# EAGLE design AeroQuadMini_v105 (EAGLE 5.11)
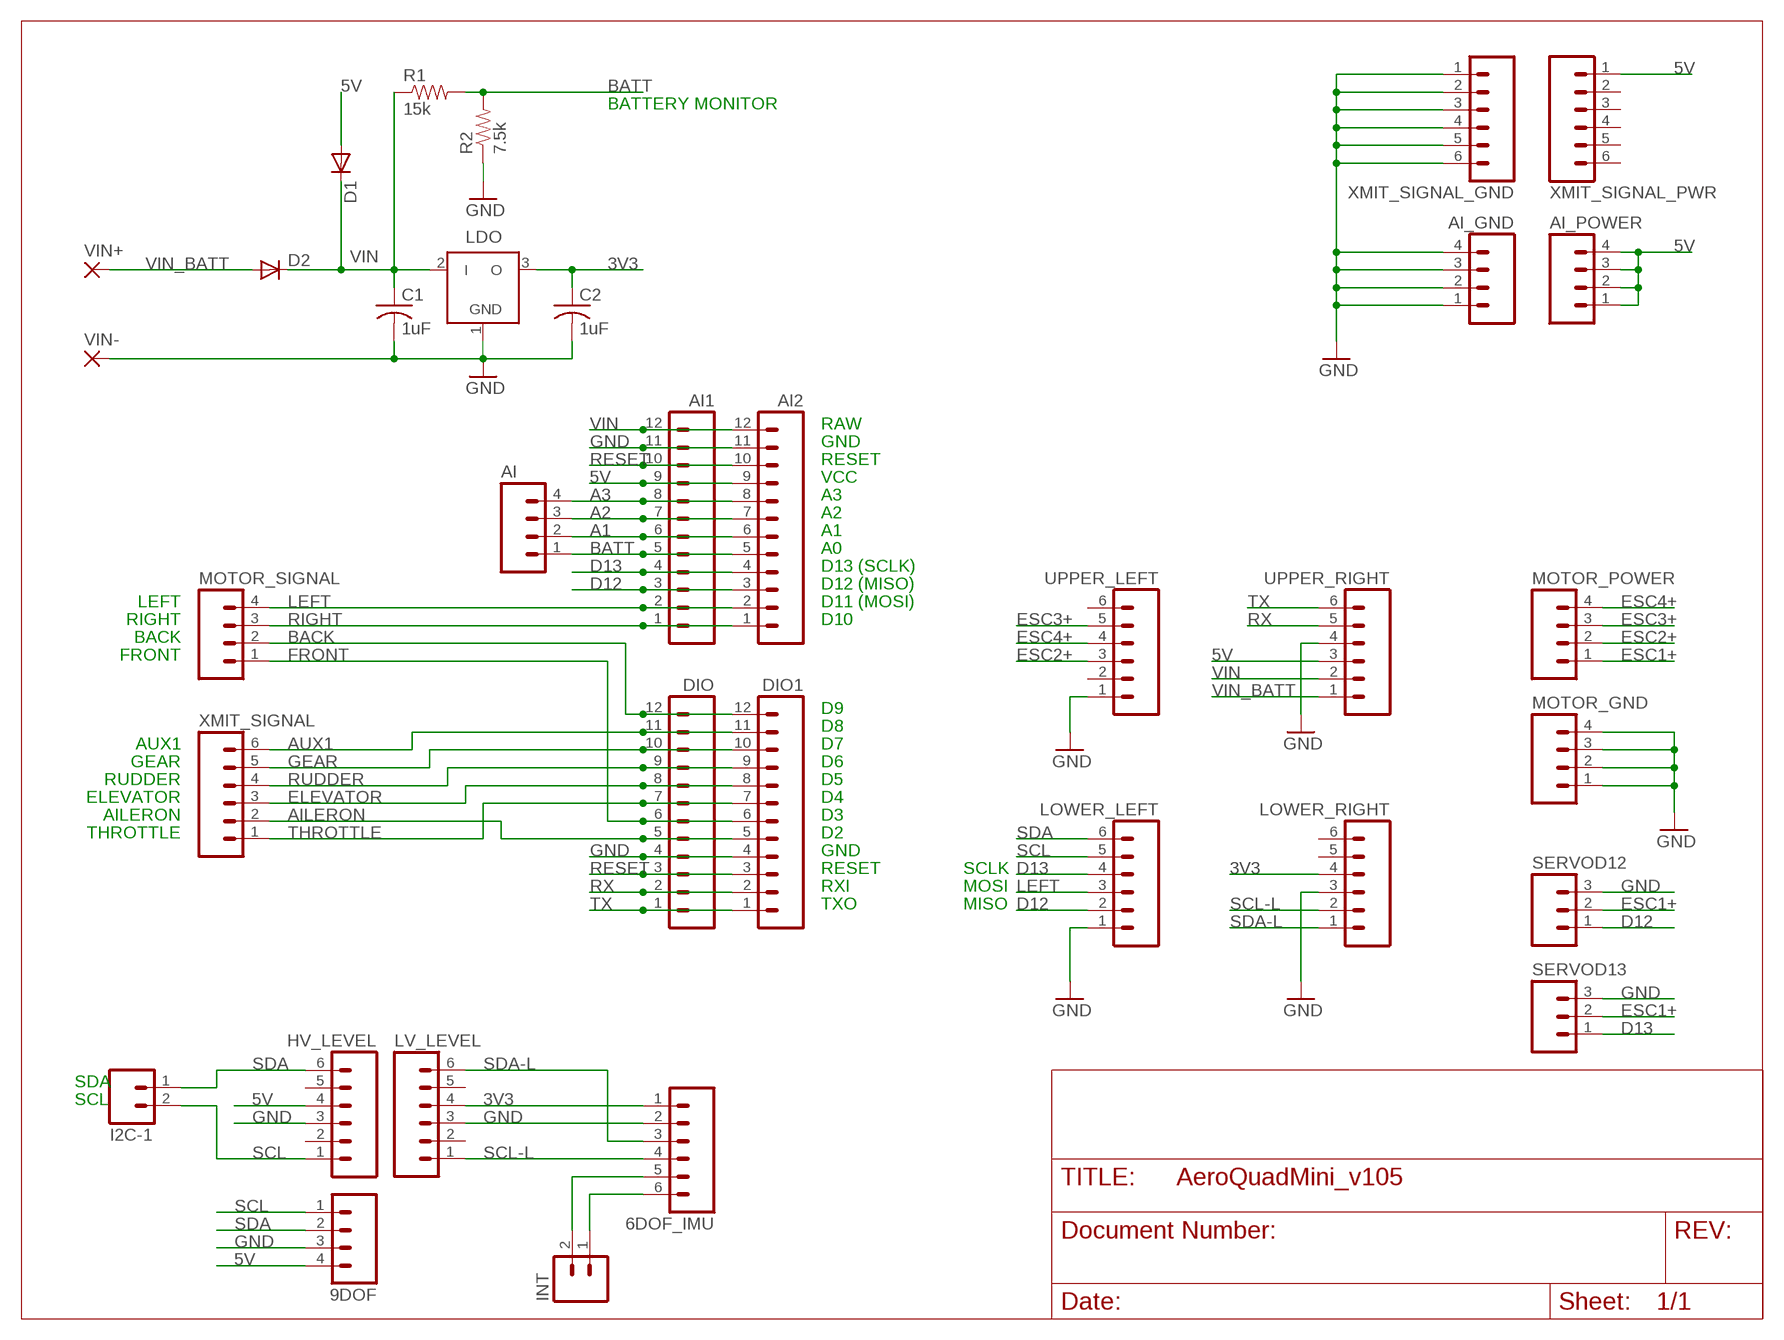
[diagram p0: schematic, sheet 1]

## Parts
6DOF_IMU  M06LOCK  [1X06_LOCK]
9DOF  M04LOCK  [1X04_LOCK]
AI  M04LOCK  [1X04_LOCK]
AI1  M12LOCK  [1X12_LOCK]
AI2  M12LOCK  [1X12_LOCK]
AI_GND  M04LOCK  [1X04_LOCK]
AI_POWER  M04LOCK  [1X04_LOCK]
C1  1uF  C-US050-024X044  [C050-024X044]
C2  1uF  C-US050-024X044  [C050-024X044]
D1  DIODEPTH  [DIODE-1N4001]
D2  DIODEPTH  [DIODE-1N4001]
DIO  M12LOCK  [1X12_LOCK]
DIO1  M12LOCK  [1X12_LOCK]
HV_LEVEL  M06LOCK  [1X06_LOCK]
I2C-1  M02LOCK  [1X02_LOCK]
INT  M02PTH  [1X02]
LDO  MCP1702-33  MCP1702Z  [TO92]
LOWER_LEFT  M06LOCK  [1X06_LOCK]
LOWER_RIGHT  M06LOCK  [1X06_LOCK]
LV_LEVEL  M06LOCK  [1X06_LOCK]
MOTOR_GND  M04LOCK  [1X04_LOCK]
MOTOR_POWER  M04LOCK  [1X04_LOCK]
MOTOR_SIGNAL  M04LOCK  [1X04_LOCK]
R1  15k  RESISTORPTH-1/6W  [1/6W-RES]
R2  7.5k  RESISTORPTH-1/6W  [1/6W-RES]
SERVOD12  M03LOCK  [1X03_LOCK]
SERVOD13  M03LOCK  [1X03_LOCK]
UPPER_LEFT  M06LOCK  [1X06_LOCK]
UPPER_RIGHT  M06LOCK  [1X06_LOCK]
VIN+  3,81/1,4  [3,81/1,4]
VIN-  3,81/1,4  [3,81/1,4]
XMIT_SIGNAL  M06LOCK  [1X06_LOCK]
XMIT_SIGNAL_GND  M06LOCK  [1X06_LOCK]
XMIT_SIGNAL_PWR  M06LOCK  [1X06_LOCK]

## Nets
3V3: 6DOF_IMU.1 C2.1 LDO.3(O) LOWER_RIGHT.4 LV_LEVEL.4
5V: 9DOF.4 AI1.9 AI2.9 AI_POWER.1 AI_POWER.2 AI_POWER.3 AI_POWER.4 D1.A HV_LEVEL.4 UPPER_RIGHT.3 XMIT_SIGNAL_PWR.1
A1: AI1.6 AI2.6 AI.2
A2: AI1.7 AI2.7 AI.3
A3: AI1.8 AI2.8 AI.4
AILERON: DIO1.5 DIO.5 XMIT_SIGNAL.2
AUX1: DIO1.11 DIO.11 XMIT_SIGNAL.6
BACK: DIO1.12 DIO.12 MOTOR_SIGNAL.2
BATT: AI1.5 AI2.5 AI.1 R1.2 R2.2
D12: AI1.3 AI2.3 LOWER_LEFT.2 SERVOD12.1
D13: AI1.4 AI2.4 LOWER_LEFT.4 SERVOD13.1
ELEVATOR: DIO1.8 DIO.8 XMIT_SIGNAL.3
ESC1+: MOTOR_POWER.1 SERVOD12.2 SERVOD13.2
ESC2+: MOTOR_POWER.2 UPPER_LEFT.3
ESC3+: MOTOR_POWER.3 UPPER_LEFT.5
ESC4+: MOTOR_POWER.4 UPPER_LEFT.4
FRONT: DIO1.6 DIO.6 MOTOR_SIGNAL.1
GEAR: DIO1.10 DIO.10 XMIT_SIGNAL.5
GND: 6DOF_IMU.2 9DOF.3 AI1.11 AI2.11 AI_GND.1 AI_GND.2 AI_GND.3 AI_GND.4 C1.2 C2.2 DIO1.4 DIO.4 HV_LEVEL.3 LDO.1(GND) LOWER_LEFT.1 LOWER_RIGHT.3 LV_LEVEL.3 MOTOR_GND.1 MOTOR_GND.2 MOTOR_GND.3 MOTOR_GND.4 R2.1 SERVOD12.3 SERVOD13.3 UPPER_LEFT.1 UPPER_RIGHT.4 VIN-.1(P) XMIT_SIGNAL_GND.1 XMIT_SIGNAL_GND.2 XMIT_SIGNAL_GND.3 XMIT_SIGNAL_GND.4 XMIT_SIGNAL_GND.5 XMIT_SIGNAL_GND.6
LEFT: AI1.2 AI2.2 LOWER_LEFT.3 MOTOR_SIGNAL.4
N$1: 6DOF_IMU.5 INT.2
N$2: 6DOF_IMU.6 INT.1
RESET: AI1.10 AI2.10 DIO1.3 DIO.3
RIGHT: AI1.1 AI2.1 MOTOR_SIGNAL.3
RUDDER: DIO1.9 DIO.9 XMIT_SIGNAL.4
RX: DIO1.2 DIO.2 UPPER_RIGHT.5
SCL: 9DOF.1 HV_LEVEL.1 I2C-1.2 LOWER_LEFT.5
SCL-L: 6DOF_IMU.4 LOWER_RIGHT.2 LV_LEVEL.1
SDA: 9DOF.2 HV_LEVEL.6 I2C-1.1 LOWER_LEFT.6
SDA-L: 6DOF_IMU.3 LOWER_RIGHT.1 LV_LEVEL.6
THROTTLE: DIO1.7 DIO.7 XMIT_SIGNAL.1
TX: DIO1.1 DIO.1 UPPER_RIGHT.6
VIN: AI1.12 AI2.12 C1.1 D1.C D2.C LDO.2(I) R1.1 UPPER_RIGHT.2
VIN_BATT: D2.A UPPER_RIGHT.1 VIN+.1(P)
Unconnected: HV_LEVEL.2 HV_LEVEL.5 LOWER_RIGHT.5 LOWER_RIGHT.6 LV_LEVEL.2 LV_LEVEL.5 UPPER_LEFT.2 UPPER_LEFT.6 XMIT_SIGNAL_PWR.2 XMIT_SIGNAL_PWR.3 XMIT_SIGNAL_PWR.4 XMIT_SIGNAL_PWR.5 XMIT_SIGNAL_PWR.6

## Notes on the sheet
- BATTERY MONITOR
- RAW
- GND
- RESET
- VCC
- A3
- A2
- A1
- A0
- D13 (SCLK)
- D12 (MISO)
- LEFT | D11 (MOSI)
- RIGHT | D10
- BACK
- FRONT
- D9
- D8
- AUX1 | D7
- GEAR | D6
- RUDDER | D5
- ELEVATOR | D4
- AILERON | D3
- THROTTLE | D2
- GND
- RESET | SCLK
- RXI | MOSI
- TXO | MISO
- SDA
- SCL

## Library data of the parts
6DOF_IMU HV_LEVEL LOWER_LEFT LOWER_RIGHT LV_LEVEL UPPER_LEFT UPPER_RIGHT XMIT_SIGNAL XMIT_SIGNAL_GND XMIT_SIGNAL_PWR = SparkFun:M06: Header 6 Standard 6-pin 0.1" header. Use with straight break away headers (SKU : PRT-00116), right angle break away headers (PRT-00553), swiss pins (PRT-00743), machine pins (PRT-00117), and female headers (PRT-00115). Molex polarized connector foot print use with SKU : PRT-08094 with associated crimp pins and housings. NOTES ON THE VARIANTS LOCK and LOCK_LONGPADS... This footprint was designed to help hold the alignment of a through-hole component (i.e. 6-pin header) while soldering it into place. You may notice that each hole has been shifted either up or down by 0.005 of an inch from it's more standard position (which is a perfectly straight line). This slight alteration caused the pins (the squares in the middle) to touch the edges of the holes. Because they are alternating, it causes a "brace" to hold the component in place. 0.005 has proven to be the perfect amount of "off-center" position when using our standard breakaway headers. Although looks a little odd when you look at the bare footprint, once you have a header in there, the alteration is very hard to notice. Also, if you push a header all the way into place, it is covered up entirely on the bottom side. This idea of altering the position of holes to aid alignment will be further integrated into the Sparkfun Library for other footprints. It can help hold any component with 3 or more connection pins.
9DOF AI AI_GND AI_POWER MOTOR_GND MOTOR_POWER MOTOR_SIGNAL = SparkFun:M04: Header 4 Standard 4-pin 0.1" header. Use with straight break away headers (SKU : PRT-00116), right angle break away headers (PRT-00553), swiss pins (PRT-00743), machine pins (PRT-00117), and female headers (PRT-00115). Molex polarized connector foot print use with SKU : PRT-08231 with associated crimp pins and housings. 1MM SMD Version SKU: PRT-10208
AI1 AI2 DIO DIO1 = SparkFun:M12: Header 12 Standard 12-pin 0.1" header. Use with straight break away headers (SKU : PRT-00116), right angle break away headers (PRT-00553), swiss pins (PRT-00743), machine pins (PRT-00117), and female headers (PRT-00115).
C1 C2 = resistor:C-US: CAPACITOR, American symbol
D1 D2 = SparkFun:DIODE: Diode These are standard reverse protection diodes and small signal diodes. SMA package can handle up to about 1A. SOD-323 can handle about 200mA. What the SOD-323 package when ordering, there are some mfgs out there that are 5-pin packages.
I2C-1 INT = SparkFun:M02: Header 2 Standard 2-pin 0.1" header. Use with straight break away headers (SKU : PRT-00116), right angle break away headers (PRT-00553), swiss pins (PRT-00743), machine pins (PRT-00117), and female headers (PRT-00115). Molex polarized connector foot print use with SKU : PRT-08233 with associated crimp pins and housings.
LDO = JeeLabs:MCP1702: 200 mA, Low Power Low Dropout Voltage Regulator
R1 R2 = SparkFun:RESISTOR: Resistor Basic schematic elements and footprints for 0603, 1206, and PTH 1/10th watt (small) resistors.
SERVOD12 SERVOD13 = SparkFun:M03: Header 3 Standard 3-pin 0.1" header. Use with straight break away headers (SKU : PRT-00116), right angle break away headers (PRT-00553), swiss pins (PRT-00743), machine pins (PRT-00117), and female headers (PRT-00115). Molex polarized connector foot print use with SKU : PRT-08232 with associated crimp pins and housings.
VIN+ VIN- = wirepad:3,81/1,4: THROUGH-HOLE PAD

## Net classes
1 power: width 0.381 mm, clearance 0.254 mm

## Board
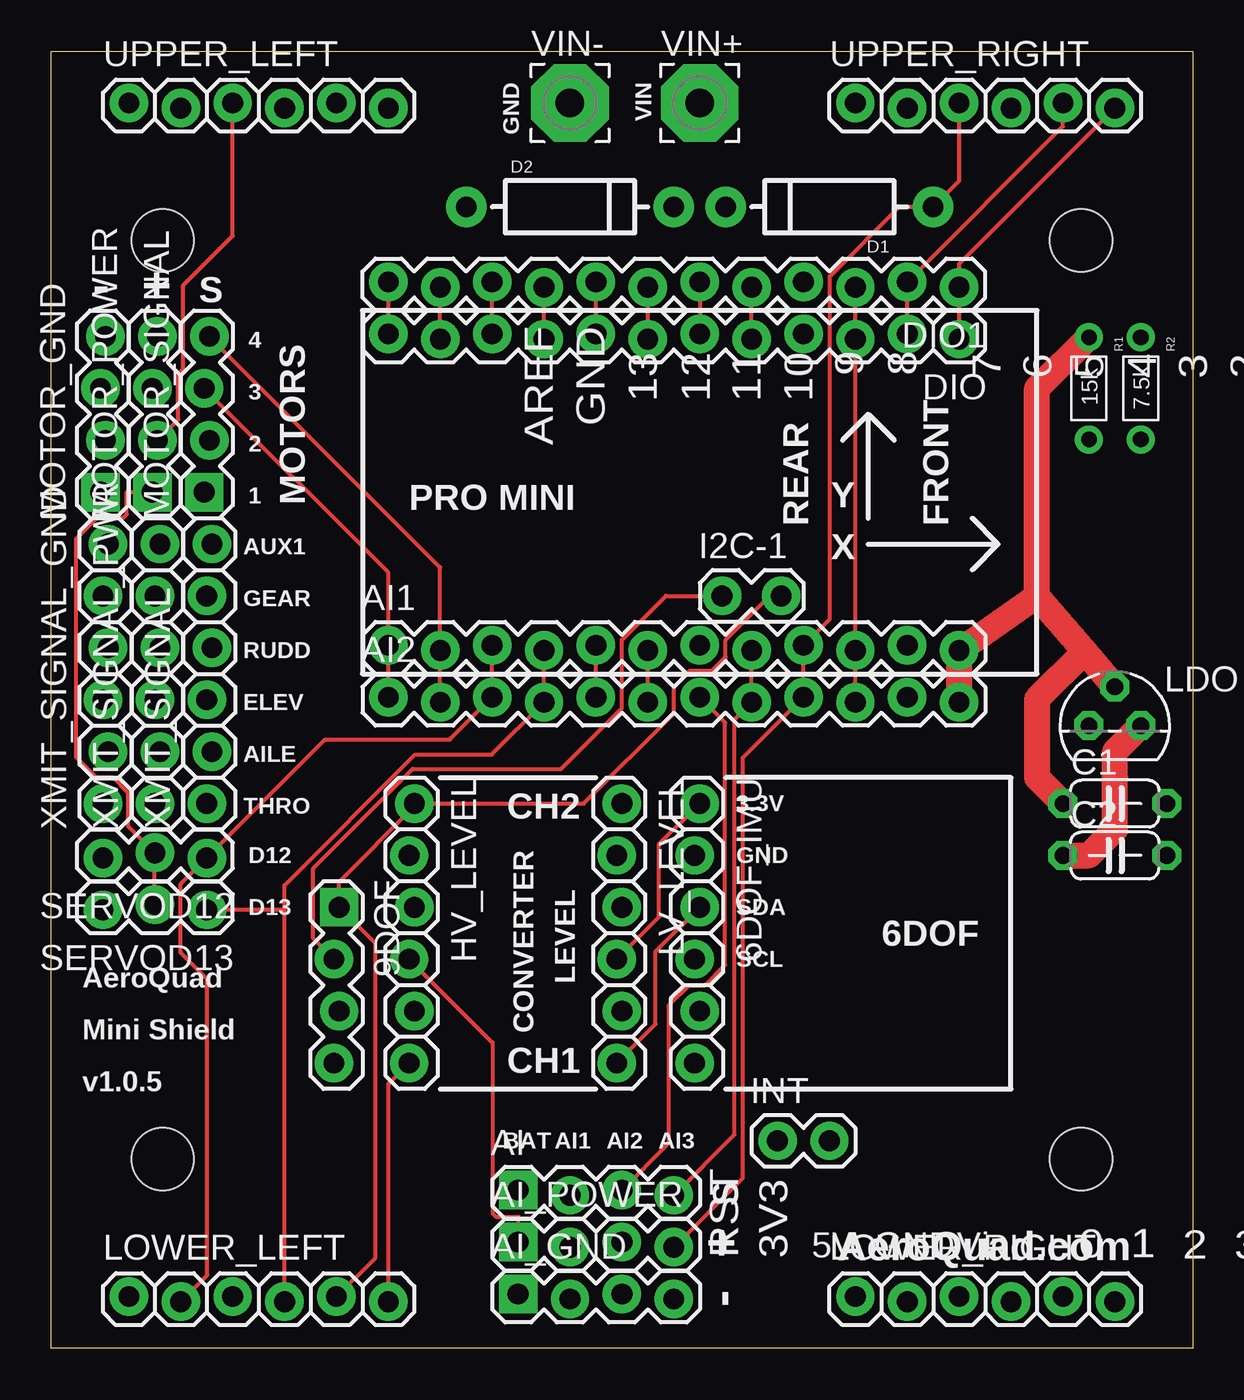
[diagram p1: board, top side]
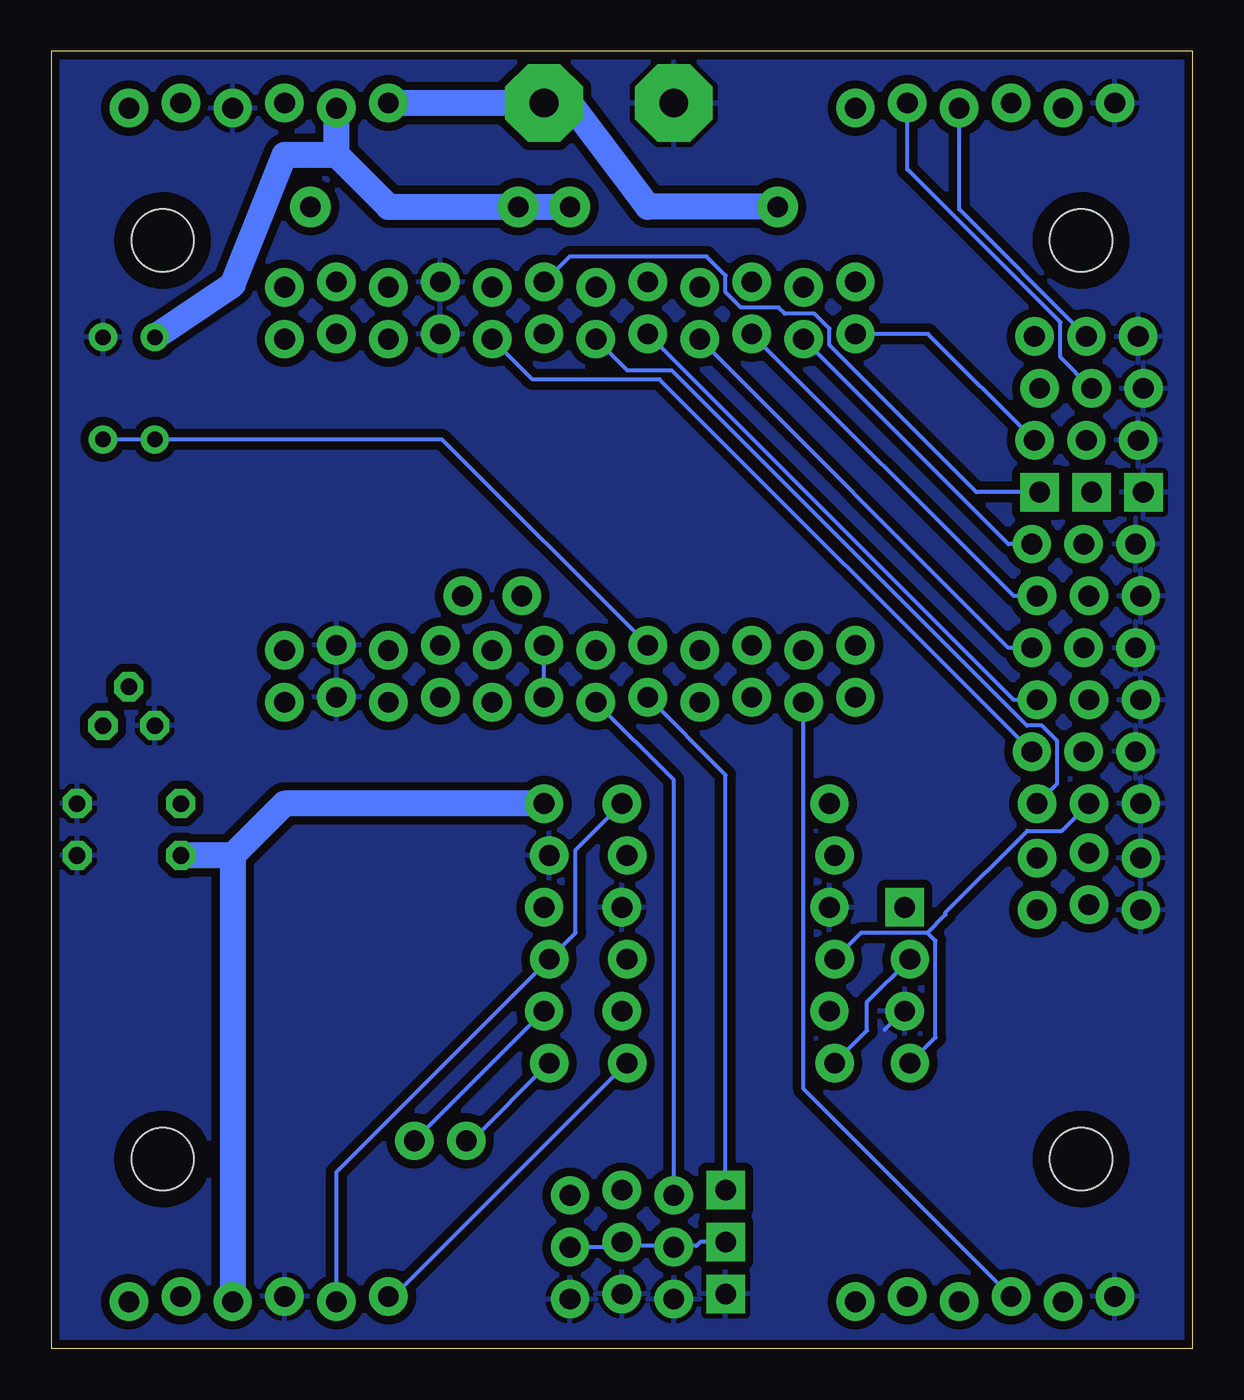
[diagram p2: board, bottom side, seen from below]

Size 55.88 x 63.5 mm. Coordinates in mm from the lower left corner, seen from the top.
Outline: 0,63.5 55.88,63.5 55.88,0 0,0 0,63.5
Copper layers (1*16): Top 0.035mm / dielectric 1.5mm / Bottom 0.035mm
Design rules "SparkFun": minimum track width 8mil, minimum drill 20mil, track to track 8mil, track to pad 8mil, pad to pad 8mil, via to via 8mil, smd to smd 8mil, copper to edge 10mil, drill to drill 8mil, minimum pad ring 12mil, minimum via ring 10mil, stop-mask expansion 4mil, vias tented up to drill 25mil, thermal gap 10mil

### Footprints (pad centres in the part's own frame; a part is rotated, then mirrored left to right if it is on the bottom)
1X06_LOCK = drill 1.016 pad 1.88 round: 1 0,0; 2 2.54,-0.254; 3 5.08,0; 4 7.62,-0.254; 5 10.16,0; 6 12.7,-0.254
1X04_LOCK = drill 1.016 pad 1.88 square: 1 0,0.127 | drill 1.016 pad 1.88 round: 2 2.54,-0.127; 3 5.08,0.127; 4 7.62,-0.127
1X12_LOCK = drill 1.016 pad 1.88 round: 1 0,0.127; 2 2.54,-0.127; 3 5.08,0.127; 4 7.62,-0.127; 5 10.16,0.127; 6 12.7,-0.127; 7 15.24,0.127; 8 17.78,-0.127; 9 20.32,0.127; 10 22.86,-0.127; 11 25.4,0.127; 12 27.94,-0.127
C050-024X044 = drill 0.813 octagon: 1 -2.54,0; 2 2.54,0
DIODE-1N4001 = drill 1 pad 1.981 round: A -5.08,0; C 5.08,0
1X02_LOCK = drill 1.016 pad 1.88 round: 1 -0.178,0; 2 2.718,0
1X02 = drill 1.016 pad 1.88 round: 1 0,0; 2 2.54,0
TO92 = drill 0.813 octagon: 1 -1.27,0; 2 0,1.905; 3 1.27,0
1/6W-RES = drill 0.762 round: 1 -2.5,0; 2 2.5,0
1X03_LOCK = drill 1.016 pad 1.88 round: 1 0,0.127; 2 2.54,-0.127; 3 5.08,0.127
STAND-OFF-TIGHT = hole 3.048: 0,0
3,81/1,4 = drill 1.397 pad 3.81 octagon: 1 0,0

### Placement (x,y rotation side)
6DOF_IMU  31.75,26.67 270 top
9DOF  13.97,21.59 270 top
AI  22.86,7.62 0 top
AI1  16.51,34.29 0 top
AI2  16.51,31.75 0 top
AI_GND  22.86,2.54 0 top
AI_POWER  22.86,5.08 0 top
C1  52.07,26.67 0 top
C2  52.07,24.13 0 top
D1  38.1,55.88 180 top
D2  25.4,55.88 0 top
DIO  44.45,49.53 180 top
DIO1  44.45,52.07 180 top
HV_LEVEL  17.78,26.67 270 top
I2C-1  33.02,36.83 0 top
INT  35.56,10.16 0 top
LDO  52.07,30.48 0 top
LOWER_LEFT  3.81,2.54 0 top
LOWER_RIGHT  39.37,2.54 0 top
LV_LEVEL  27.94,26.67 270 top
MOTOR_GND  2.54,41.91 90 top
MOTOR_POWER  5.08,41.91 90 top
MOTOR_SIGNAL  7.62,41.91 90 top
R1  50.8,46.99 270 top
R2  53.34,46.99 270 top
SERVOD12  7.62,24.13 180 top
SERVOD13  7.62,21.59 180 top
U$1  [STAND-OFF-TIGHT]  5.46,9.27 0 top
U$2  [STAND-OFF-TIGHT]  50.42,9.27 0 top
U$3  [STAND-OFF-TIGHT]  50.42,54.23 0 top
U$5  [STAND-OFF-TIGHT]  5.46,54.23 0 top
UPPER_LEFT  3.81,60.96 0 top
UPPER_RIGHT  39.37,60.96 0 top
VIN+  31.75,60.96 0 top
VIN-  25.4,60.96 0 top
XMIT_SIGNAL  7.62,26.67 90 top
XMIT_SIGNAL_GND  2.54,26.67 90 top
XMIT_SIGNAL_PWR  5.08,26.67 90 top

### Tracks (layer width: path | path; a pad name or v marks a point on that pad's centre or on a via)
3V3
  Top 0.203: LV_LEVEL.4 29.77,21.13 29.77,24.68 6DOF_IMU.1
  Top 1.27: C2.1 50.8,24.13 52.07,25.4 52.07,27.94 52.07,29.21 LDO.3
  Bottom 1.27: 6DOF_IMU.1 44.45,26.67 46.99,24.13 | 46.99,24.13 C2.1 | 46.99,24.13 LOWER_RIGHT.4
5V
  Top 0.203: AI_POWER.4 33.87,8.34 33.87,28.91 AI2.9 AI1.9 38.12,35.7 38.12,52.47 41.53,55.88 D1.A 44.45,57.15 UPPER_RIGHT.3 | AI_POWER.1 22.86,6.45 21.77,6.45 21.61,6.61 21.61,14.96 HV_LEVEL.4
  Bottom 0.203: AI_POWER.4 28.19,4.95 AI_POWER.3 27.75,5.02 25.4,5.02 | 25.4,5.02 24.3,5.02 24.11,5.21 AI_POWER.1 | 25.4,5.02 AI_POWER.2 | XMIT_SIGNAL_PWR.1 6.41,25.34 8.1,25.34 12.1,21.34 12.1,21.23 12.98,20.34 | 12.98,20.34 16.23,20.34 HV_LEVEL.4 | 12.98,20.34 12.59,19.96 12.59,15.22 9DOF.4
A1
  Top 0.203: AI2.6 AI1.6
  Bottom 0.203: AI2.6 25.4,27.81 AI.2
A2
  Top 0.203: AI2.7 33,30.63 33,18.77 32,17.78 31.22,17.78 30.25,16.81 30.25,10.06 AI.3
  Bottom 0.203: AI2.7 AI1.7
A3
  Top 0.203: AI.4 33.46,10.47 33.46,30.79 AI2.8 AI1.8
AILERON
  Top 0.203: DIO.5 DIO1.5
  Bottom 0.203: XMIT_SIGNAL.2 26.09,47.42 32.31,47.42 DIO.5
AUX1
  Top 0.203: DIO.11 DIO1.11
  Bottom 0.203: XMIT_SIGNAL.6 9.02,39.37 DIO.11
BACK
  Top 0.203: DIO.12 DIO1.12
  Bottom 0.203: MOTOR_SIGNAL.2 12.95,49.66 DIO.12
BATT
  Top 0.203: AI2.5 AI1.5
  Bottom 0.203: AI2.5 22.86,28.07 AI.1 | AI1.5 36.74,44.49 R1.2 R2.2
D12
  Top 0.203: LOWER_LEFT.2 7.64,3.58 7.64,18.07 6.35,19.36 6.35,22.73 SERVOD12.1 13.41,29.8 19.51,29.8 AI2.3 AI1.3
D13
  Top 0.203: 11.43,21.46 11.43,22.67 17.82,29.07 21.57,29.07 AI2.4 AI1.4 | LOWER_LEFT.4 11.43,21.46 | 11.43,21.46 SERVOD13.1
ELEVATOR
  Top 0.203: DIO.8 DIO1.8
  Bottom 0.203: XMIT_SIGNAL.3 8.76,31.75 DIO.8
ESC1+
  Top 0.203: SERVOD13.2 SERVOD12.2 3.79,25.55 3.79,27.2 3.04,27.94 2.22,27.94 1.24,28.92 1.24,39.64 2.26,40.66 3.55,40.66 3.71,40.82 3.71,41.91 MOTOR_POWER.1
ESC2+
  Top 0.203: UPPER_LEFT.3 8.89,54.46 6.48,52.05 6.48,47.94 6.22,47.69 6.22,45.47 MOTOR_POWER.2
ESC3+
  Bottom 0.203: UPPER_LEFT.5 13.97,57.72 6.48,50.23 6.48,48.51 MOTOR_POWER.3
ESC4+
  Bottom 0.203: UPPER_LEFT.4 11.43,55.75 MOTOR_POWER.4
FRONT
  Top 0.203: DIO1.6 DIO.6
  Bottom 0.203: MOTOR_SIGNAL.1 10.58,41.91 17.78,49.11 17.78,49.91 18.51,50.65 19.96,50.65 20.27,50.95 22.11,50.95 22.86,51.7 22.86,52.52 23.79,53.45 30.5,53.45 DIO1.6
GEAR
  Top 0.203: DIO.10 DIO1.10
  Bottom 0.203: XMIT_SIGNAL.5 8.76,36.83 DIO.10
GND
  Bottom 0.203: 9DOF.3 14.22,16.46 15.04,15.65 15.07,15.61
  pour Bottom (isolate 0.406): 0,63.5 55.88,63.5 55.88,0 0,0
LEFT
  Top 0.203: AI2.2 AI1.2 19.05,38.23 MOTOR_SIGNAL.4
  Bottom 0.203: LOWER_LEFT.3 19.05,12.7 AI2.2
N$1
  Bottom 0.203: 6DOF_IMU.5 INT.2
N$2
  Bottom 0.203: INT.1 35.31,10.16 6DOF_IMU.6
RESET
  Top 0.203: AI2.10 AI1.10 DIO.3 DIO1.3
RIGHT
  Top 0.203: AI2.1 AI1.1 16.51,37.97 MOTOR_SIGNAL.3
RUDDER
  Top 0.203: DIO.9 DIO1.9
  Bottom 0.203: XMIT_SIGNAL.4 9.02,34.29 DIO.9
RX
  Top 0.203: DIO.2 DIO1.2 49.53,59.82 UPPER_RIGHT.5
SCL
  Top 0.203: I2C-1.2 35.17,36.83 33.02,34.68 33.02,33.84 32.35,33.17 31.27,33.17 30.48,32.38 30.48,31.08 26.07,26.67 HV_LEVEL.1 17.78,26.52 14.1,22.84 9DOF.1 14.1,21.46 14.22,21.46 15.88,19.81 15.88,4.45 LOWER_LEFT.5
SCL-L
  Bottom 0.203: LOWER_RIGHT.2 41.91,8.64 6DOF_IMU.4 30.2,20.34 30.2,24.41 LV_LEVEL.1
SDA
  Top 0.203: 9DOF.2 12.84,20.06 12.84,23.5 17.7,28.37 24.96,28.37 27.94,31.35 27.94,34.67 30.1,36.83 I2C-1.1 | LOWER_LEFT.6 16.51,12.95 HV_LEVEL.6
  Bottom 0.203: HV_LEVEL.6 15.94,15.56 15.94,16.95 9DOF.2
SDA-L
  Top 0.203: 6DOF_IMU.3 29.59,19.43 29.59,15.88 LV_LEVEL.6
  Bottom 0.203: LV_LEVEL.6 39.12,2.54 LOWER_RIGHT.1
THROTTLE
  Top 0.203: DIO.7 DIO1.7
  Bottom 0.203: XMIT_SIGNAL.1 6.63,27.66 6.63,29.73 7.38,30.48 8.12,30.48 25.5,47.86 27.67,47.86 DIO.7
TX
  Top 0.203: DIO.1 DIO1.1 44.45,53.09 UPPER_RIGHT.6
VIN
  Top 1.27: R1.1 48.26,46.99 48.26,36.83 | 48.26,36.83 AI1.12 AI2.12 | 48.26,36.83 50.59,34.11 | 50.59,34.11 LDO.2 | C1.1 48.26,27.94 48.26,31.75 48.26,31.78 50.59,34.11
  Bottom 1.27: D2.C D1.C 39.37,55.88 41.91,58.42 | 41.91,58.42 UPPER_RIGHT.2 | 41.91,58.42 44.45,58.42 46.99,52.07 R1.1
VIN_BATT
  Bottom 1.27: D2.A 26.67,55.88 30.48,60.96 VIN+.1 UPPER_RIGHT.1

### Text on the board
tPlace: GND | VIN | - | + | S | 4 | MOTORS | 3 | 2 | 1 | PRO MINI | Y | REAR | X | FRONT | AUX1 | GEAR | RUDD | ELEV | AILE | CH2 | THRO | 3.3V | D12 | CONVERTER | GND | LEVEL | D13 | SDA | 6DOF | SCL | AeroQuad | Mini Shield | CH1 | v1.0.5 | BAT | AI1 | AI2 | AI3 | S | + | AeroQuad.com | -
tNames: 9 | 8 | 7 | 6 | 5 | 4 | 3 | 2 | 1 | 0 | 13 | 12 | 11 | 10 | GND | AREF | RST | 3V3 | 5V | GND | Vin | 0 | 1 | 2 | 3 | 4 | 5